# Altium project SmartHaloEE.PrjPcb (part 2 of 2)

## Sheet LEDS2.SchDoc: LEDS 2
size B; Author: Sébastien Gélinas; Organization: SmartHalo; Address1: 5445 de Gaspé; Address2: Montréal, QC; Address3: Canada; Address4: H2T 3B2; Revision: 1; SheetNumber: 4; SheetTotal: 4
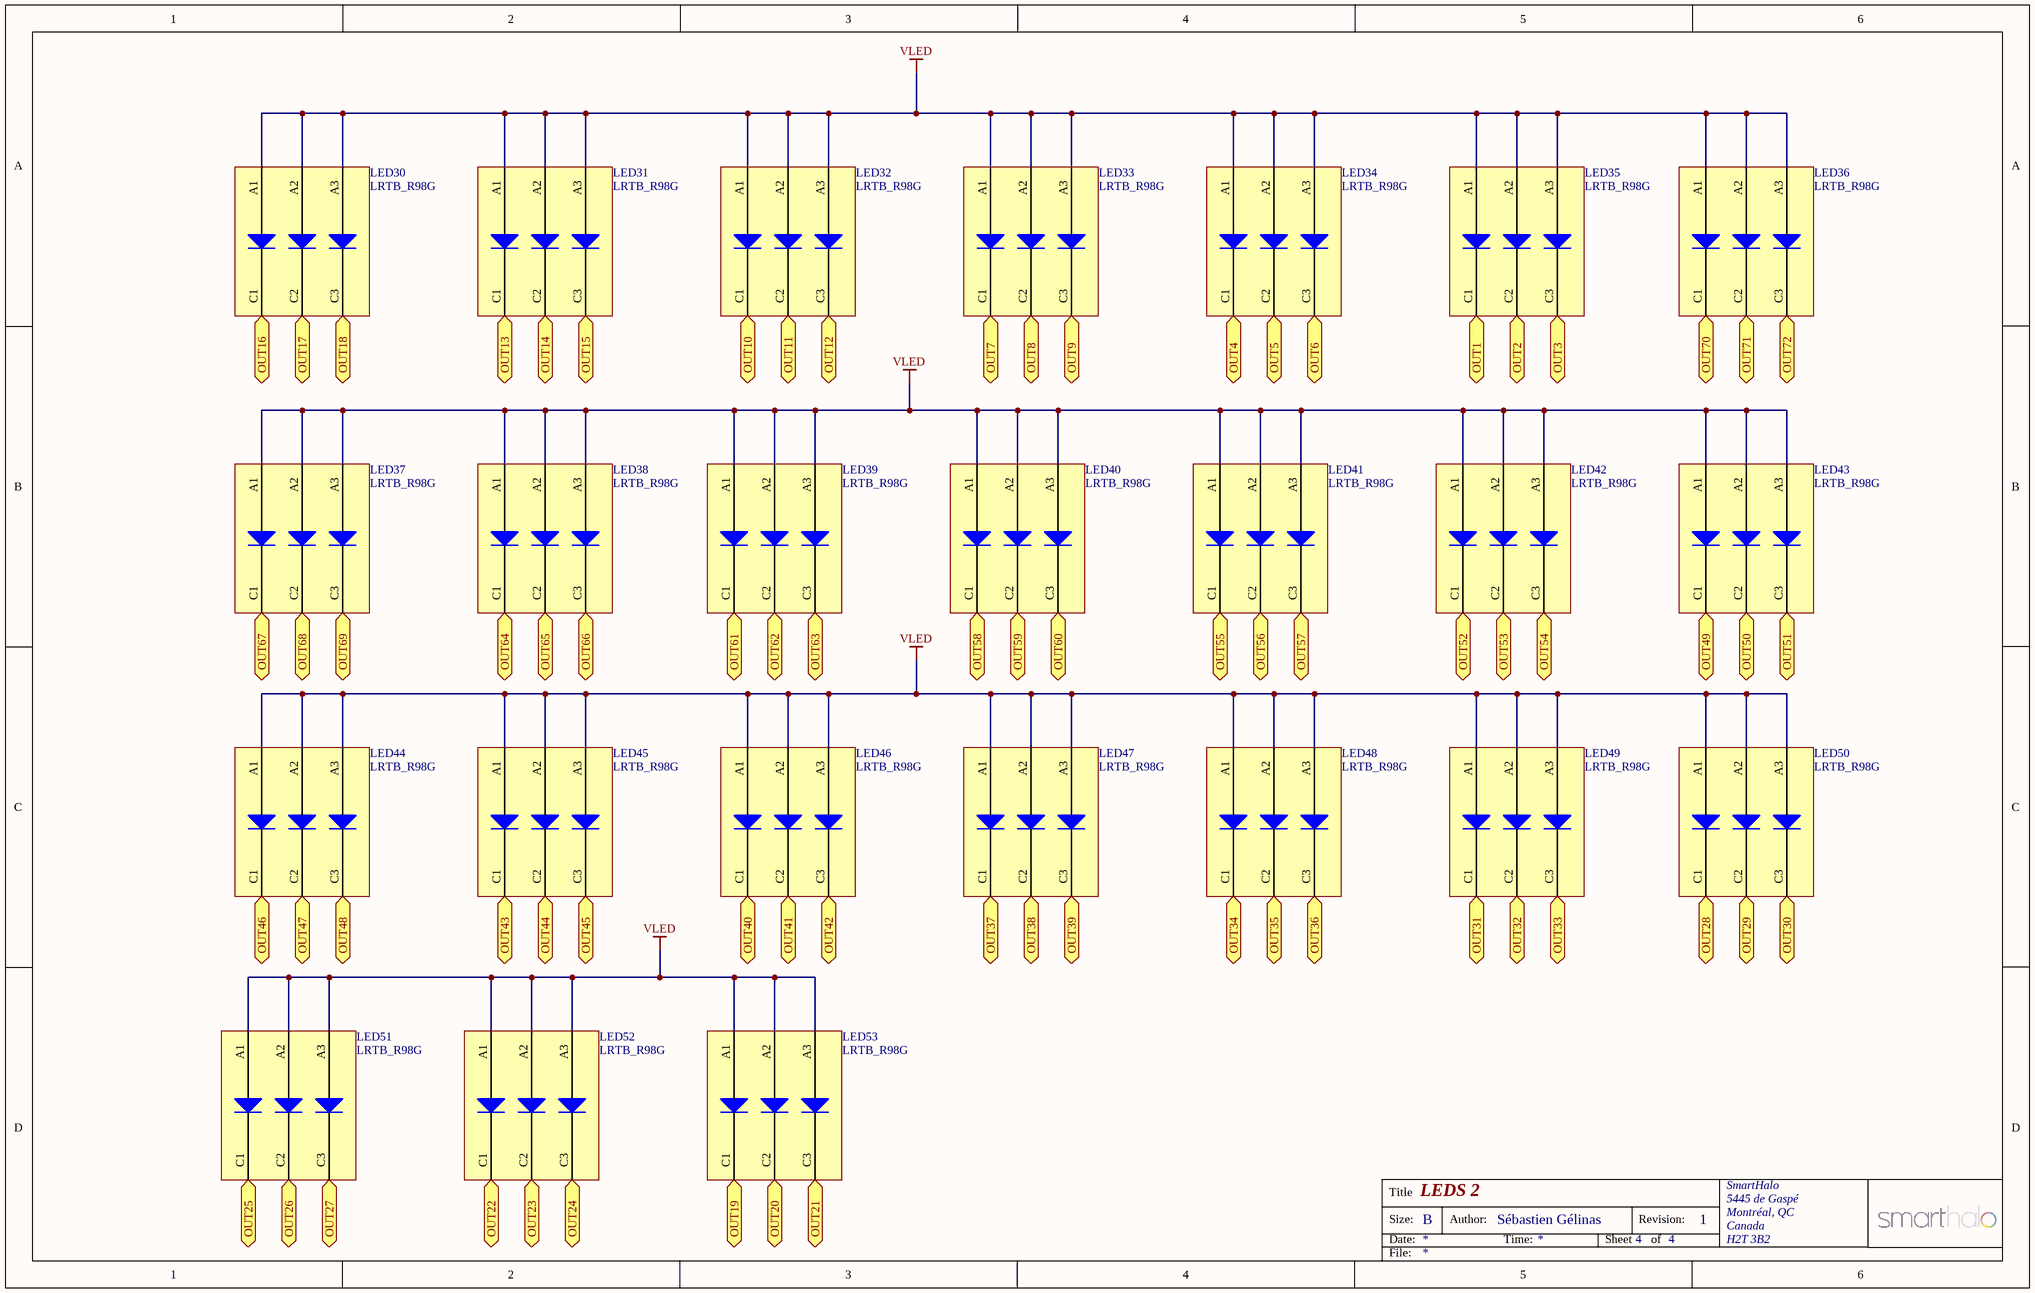
[diagram p7: LEDS2.SchDoc]

### Parts
LED30  LRTB_R98G  [LRTB_R98G]
LED31  LRTB_R98G  [LRTB_R98G]
LED32  LRTB_R98G  [LRTB_R98G]
LED33  LRTB_R98G  [LRTB_R98G]
LED34  LRTB_R98G  [LRTB_R98G]
LED35  LRTB_R98G  [LRTB_R98G]
LED36  LRTB_R98G  [LRTB_R98G]
LED37  LRTB_R98G  [LRTB_R98G]
LED38  LRTB_R98G  [LRTB_R98G]
LED39  LRTB_R98G  [LRTB_R98G]
LED40  LRTB_R98G  [LRTB_R98G]
LED41  LRTB_R98G  [LRTB_R98G]
LED42  LRTB_R98G  [LRTB_R98G]
LED43  LRTB_R98G  [LRTB_R98G]
LED44  LRTB_R98G  [LRTB_R98G]
LED45  LRTB_R98G  [LRTB_R98G]
LED46  LRTB_R98G  [LRTB_R98G]
LED47  LRTB_R98G  [LRTB_R98G]
LED48  LRTB_R98G  [LRTB_R98G]
LED49  LRTB_R98G  [LRTB_R98G]
LED50  LRTB_R98G  [LRTB_R98G]
LED51  LRTB_R98G  [LRTB_R98G]
LED52  LRTB_R98G  [LRTB_R98G]
LED53  LRTB_R98G  [LRTB_R98G]

### Ports
OUT1, OUT2, OUT3, OUT4, OUT5, OUT6, OUT7, OUT8, OUT9, OUT10, OUT11, OUT12, OUT13, OUT14, OUT15, OUT16, OUT17, OUT18, OUT19, OUT20, OUT21, OUT22, OUT23, OUT24, OUT25, OUT26, OUT27, OUT28, OUT29, OUT30, OUT31, OUT32, OUT33, OUT34, OUT35, OUT36, OUT37, OUT38, OUT39, OUT40, OUT41, OUT42, OUT43, OUT44, OUT45, OUT46, OUT47, OUT48, OUT49, OUT50, OUT51, OUT52, OUT53, OUT54, OUT55, OUT56, OUT57, OUT58, OUT59, OUT60, OUT61, OUT62, OUT63, OUT64, OUT65, OUT66, OUT67, OUT68, OUT69, OUT70, OUT71, OUT72

### Nets
VLED: LED30.A1(Anode_Blue) LED30.A2(Anode_Green) LED30.A3(Anode_Red) LED31.A1(Anode_Blue) LED31.A2(Anode_Green) LED31.A3(Anode_Red) LED32.A1(Anode_Blue) LED32.A2(Anode_Green) LED32.A3(Anode_Red) LED33.A1(Anode_Blue) LED33.A2(Anode_Green) LED33.A3(Anode_Red) LED34.A1(Anode_Blue) LED34.A2(Anode_Green) LED34.A3(Anode_Red) LED35.A1(Anode_Blue) LED35.A2(Anode_Green) LED35.A3(Anode_Red) LED36.A1(Anode_Blue) LED36.A2(Anode_Green) LED36.A3(Anode_Red) LED37.A1(Anode_Blue) LED37.A2(Anode_Green) LED37.A3(Anode_Red) LED38.A1(Anode_Blue) LED38.A2(Anode_Green) LED38.A3(Anode_Red) LED39.A1(Anode_Blue) LED39.A2(Anode_Green) LED39.A3(Anode_Red) LED40.A1(Anode_Blue) LED40.A2(Anode_Green) LED40.A3(Anode_Red) LED41.A1(Anode_Blue) LED41.A2(Anode_Green) LED41.A3(Anode_Red) LED42.A1(Anode_Blue) LED42.A2(Anode_Green) LED42.A3(Anode_Red) LED43.A1(Anode_Blue) LED43.A2(Anode_Green) LED43.A3(Anode_Red) LED44.A1(Anode_Blue) LED44.A2(Anode_Green) LED44.A3(Anode_Red) LED45.A1(Anode_Blue) LED45.A2(Anode_Green) LED45.A3(Anode_Red) LED46.A1(Anode_Blue) LED46.A2(Anode_Green) LED46.A3(Anode_Red) LED47.A1(Anode_Blue) LED47.A2(Anode_Green) LED47.A3(Anode_Red) LED48.A1(Anode_Blue) LED48.A2(Anode_Green) LED48.A3(Anode_Red) LED49.A1(Anode_Blue) LED49.A2(Anode_Green) LED49.A3(Anode_Red) LED50.A1(Anode_Blue) LED50.A2(Anode_Green) LED50.A3(Anode_Red) LED51.A1(Anode_Blue) LED51.A2(Anode_Green) LED51.A3(Anode_Red) LED52.A1(Anode_Blue) LED52.A2(Anode_Green) LED52.A3(Anode_Red) LED53.A1(Anode_Blue) LED53.A2(Anode_Green) LED53.A3(Anode_Red)
NetLED6_C1: LED53.C1(Cathode_Blue) ; port OUT19
NetLED6_C2: LED53.C2(Cathode_Green) ; port OUT20
NetLED6_C3: LED53.C3(Cathode_Red) ; port OUT21
NetLED7_C1: LED30.C1(Cathode_Blue) ; port OUT16
NetLED7_C2: LED30.C2(Cathode_Green) ; port OUT17
NetLED7_C3: LED30.C3(Cathode_Red) ; port OUT18
NetLED8_C1: LED31.C1(Cathode_Blue) ; port OUT13
NetLED8_C2: LED31.C2(Cathode_Green) ; port OUT14
NetLED8_C3: LED31.C3(Cathode_Red) ; port OUT15
NetLED9_C1: LED32.C1(Cathode_Blue) ; port OUT10
NetLED9_C2: LED32.C2(Cathode_Green) ; port OUT11
NetLED9_C3: LED32.C3(Cathode_Red) ; port OUT12
NetLED10_C1: LED33.C1(Cathode_Blue) ; port OUT7
NetLED10_C2: LED33.C2(Cathode_Green) ; port OUT8
NetLED10_C3: LED33.C3(Cathode_Red) ; port OUT9
NetLED11_C1: LED34.C1(Cathode_Blue) ; port OUT4
NetLED11_C2: LED34.C2(Cathode_Green) ; port OUT5
NetLED11_C3: LED34.C3(Cathode_Red) ; port OUT6
NetLED12_C1: LED35.C1(Cathode_Blue) ; port OUT1
NetLED12_C2: LED35.C2(Cathode_Green) ; port OUT2
NetLED12_C3: LED35.C3(Cathode_Red) ; port OUT3
NetLED13_C1: LED36.C1(Cathode_Blue) ; port OUT70
NetLED13_C2: LED36.C2(Cathode_Green) ; port OUT71
NetLED13_C3: LED36.C3(Cathode_Red) ; port OUT72
NetLED14_C1: LED37.C1(Cathode_Blue) ; port OUT67
NetLED14_C2: LED37.C2(Cathode_Green) ; port OUT68
NetLED14_C3: LED37.C3(Cathode_Red) ; port OUT69
NetLED15_C1: LED38.C1(Cathode_Blue) ; port OUT64
NetLED15_C2: LED38.C2(Cathode_Green) ; port OUT65
NetLED15_C3: LED38.C3(Cathode_Red) ; port OUT66
NetLED16_C1: LED39.C1(Cathode_Blue) ; port OUT61
NetLED16_C2: LED39.C2(Cathode_Green) ; port OUT62
NetLED16_C3: LED39.C3(Cathode_Red) ; port OUT63
NetLED17_C1: LED40.C1(Cathode_Blue) ; port OUT58
NetLED17_C2: LED40.C2(Cathode_Green) ; port OUT59
NetLED17_C3: LED40.C3(Cathode_Red) ; port OUT60
NetLED18_C1: LED41.C1(Cathode_Blue) ; port OUT55
NetLED18_C2: LED41.C2(Cathode_Green) ; port OUT56
NetLED18_C3: LED41.C3(Cathode_Red) ; port OUT57
NetLED19_C1: LED42.C1(Cathode_Blue) ; port OUT52
NetLED19_C2: LED42.C2(Cathode_Green) ; port OUT53
NetLED19_C3: LED42.C3(Cathode_Red) ; port OUT54
NetLED20_C1: LED43.C1(Cathode_Blue) ; port OUT49
NetLED20_C2: LED43.C2(Cathode_Green) ; port OUT50
NetLED20_C3: LED43.C3(Cathode_Red) ; port OUT51
NetLED21_C1: LED44.C1(Cathode_Blue) ; port OUT46
NetLED21_C2: LED44.C2(Cathode_Green) ; port OUT47
NetLED21_C3: LED44.C3(Cathode_Red) ; port OUT48
NetLED22_C1: LED45.C1(Cathode_Blue) ; port OUT43
NetLED22_C2: LED45.C2(Cathode_Green) ; port OUT44
NetLED22_C3: LED45.C3(Cathode_Red) ; port OUT45
NetLED23_C1: LED46.C1(Cathode_Blue) ; port OUT40
NetLED23_C2: LED46.C2(Cathode_Green) ; port OUT41
NetLED23_C3: LED46.C3(Cathode_Red) ; port OUT42
NetLED24_C1: LED47.C1(Cathode_Blue) ; port OUT37
NetLED24_C2: LED47.C2(Cathode_Green) ; port OUT38
NetLED24_C3: LED47.C3(Cathode_Red) ; port OUT39
NetLED25_C1: LED48.C1(Cathode_Blue) ; port OUT34
NetLED25_C2: LED48.C2(Cathode_Green) ; port OUT35
NetLED25_C3: LED48.C3(Cathode_Red) ; port OUT36
NetLED26_C1: LED49.C1(Cathode_Blue) ; port OUT31
NetLED26_C2: LED49.C2(Cathode_Green) ; port OUT32
NetLED26_C3: LED49.C3(Cathode_Red) ; port OUT33
NetLED27_C1: LED50.C1(Cathode_Blue) ; port OUT28
NetLED27_C2: LED50.C2(Cathode_Green) ; port OUT29
NetLED27_C3: LED50.C3(Cathode_Red) ; port OUT30
NetLED28_C1: LED51.C1(Cathode_Blue) ; port OUT25
NetLED28_C2: LED51.C2(Cathode_Green) ; port OUT26
NetLED28_C3: LED51.C3(Cathode_Red) ; port OUT27
NetLED29_C1: LED52.C1(Cathode_Blue) ; port OUT22
NetLED29_C2: LED52.C2(Cathode_Green) ; port OUT23
NetLED29_C3: LED52.C3(Cathode_Red) ; port OUT24

### Notes on the sheet
- Title
- Size:
- Date:
- B
- Author:
- Time:
- Sheet
- Revision:
- of
- File:

### Library data of the parts
LED30-LED53 = LRTB_R98G: IC RGB LED OSRAM; Manufacturer: OSRAM

## Nets that join several sheets
+3.3: PWR (C17.2 U3.5), SENSORS (8 pins), BLE (11 pins)
GND: PWR (29 pins), SENSORS (8 pins), BLE (20 pins), ALARM (Q2.2), DRIVERS_CONNECTORS (25 pins)
VBZ: PWR (C3.2 D1.1 R1.2), ALARM (NT2.1)
VLED: PWR (NT3.2), DRIVERS_CONNECTORS (14 pins), LEDS1 (72 pins), LEDS2 (72 pins)
ANODE_B: CENTRALLEDS (5 pins), DRIVERS_CONNECTORS (R26.1)
ANODE_G: CENTRALLEDS (5 pins), DRIVERS_CONNECTORS (R7.1)
ANODE_R: CENTRALLEDS (5 pins), DRIVERS_CONNECTORS (R25.1)
CENTRAL_B: BLE (U4.5), DRIVERS_CONNECTORS (R28.2)
CENTRAL_G: BLE (U4.7), DRIVERS_CONNECTORS (R9.2)
CENTRAL_R: BLE (U4.6), DRIVERS_CONNECTORS (R10.2)
DRDY: SENSORS (U5.11), BLE (U4.11)
FRONTLED: BLE (U4.4), DRIVERS_CONNECTORS (R27.2)
INT_MAG: SENSORS (U5.7), BLE (U4.9)
INT_XL: SENSORS (U5.12), BLE (U4.10)
NetLED1_C1: CENTRALLEDS (5 pins), DRIVERS_CONNECTORS (Q5.6)
NetLED1_C2: CENTRALLEDS (5 pins), DRIVERS_CONNECTORS (Q6.3)
NetLED1_C3: CENTRALLEDS (5 pins), DRIVERS_CONNECTORS (Q6.6)
NetLED6_C1: DRIVERS_CONNECTORS (U6.20), LEDS1 (LED6.C1), LEDS2 (LED53.C1)
NetLED6_C2: DRIVERS_CONNECTORS (U6.21), LEDS1 (LED6.C2), LEDS2 (LED53.C2)
NetLED6_C3: DRIVERS_CONNECTORS (U6.22), LEDS1 (LED6.C3), LEDS2 (LED53.C3)
NetLED7_C1: DRIVERS_CONNECTORS (U6.15), LEDS1 (LED7.C1), LEDS2 (LED30.C1)
NetLED7_C2: DRIVERS_CONNECTORS (U6.16), LEDS1 (LED7.C2), LEDS2 (LED30.C2)
NetLED7_C3: DRIVERS_CONNECTORS (U6.17), LEDS1 (LED7.C3), LEDS2 (LED30.C3)
NetLED8_C1: DRIVERS_CONNECTORS (U6.12), LEDS1 (LED8.C1), LEDS2 (LED31.C1)
NetLED8_C2: DRIVERS_CONNECTORS (U6.13), LEDS1 (LED8.C2), LEDS2 (LED31.C2)
NetLED8_C3: DRIVERS_CONNECTORS (U6.14), LEDS1 (LED8.C3), LEDS2 (LED31.C3)
NetLED9_C1: DRIVERS_CONNECTORS (U6.9), LEDS1 (LED9.C1), LEDS2 (LED32.C1)
NetLED9_C2: DRIVERS_CONNECTORS (U6.10), LEDS1 (LED9.C2), LEDS2 (LED32.C2)
NetLED9_C3: DRIVERS_CONNECTORS (U6.11), LEDS1 (LED9.C3), LEDS2 (LED32.C3)
NetLED10_C1: DRIVERS_CONNECTORS (U6.6), LEDS1 (LED10.C1), LEDS2 (LED33.C1)
NetLED10_C2: DRIVERS_CONNECTORS (U6.7), LEDS1 (LED10.C2), LEDS2 (LED33.C2)
NetLED10_C3: DRIVERS_CONNECTORS (U6.8), LEDS1 (LED10.C3), LEDS2 (LED33.C3)
NetLED11_C1: DRIVERS_CONNECTORS (U6.2), LEDS1 (LED11.C1), LEDS2 (LED34.C1)
NetLED11_C2: DRIVERS_CONNECTORS (U6.3), LEDS1 (LED11.C2), LEDS2 (LED34.C2)
NetLED11_C3: DRIVERS_CONNECTORS (U6.5), LEDS1 (LED11.C3), LEDS2 (LED34.C3)
NetLED12_C1: DRIVERS_CONNECTORS (U6.47), LEDS1 (LED12.C1), LEDS2 (LED35.C1)
NetLED12_C2: DRIVERS_CONNECTORS (U6.48), LEDS1 (LED12.C2), LEDS2 (LED35.C2)
NetLED12_C3: DRIVERS_CONNECTORS (U6.1), LEDS1 (LED12.C3), LEDS2 (LED35.C3)
NetLED13_C1: DRIVERS_CONNECTORS (U8.36), LEDS1 (LED13.C1), LEDS2 (LED36.C1)
NetLED13_C2: DRIVERS_CONNECTORS (U8.37), LEDS1 (LED13.C2), LEDS2 (LED36.C2)
NetLED13_C3: DRIVERS_CONNECTORS (U8.38), LEDS1 (LED13.C3), LEDS2 (LED36.C3)
NetLED14_C1: DRIVERS_CONNECTORS (U8.32), LEDS1 (LED14.C1), LEDS2 (LED37.C1)
NetLED14_C2: DRIVERS_CONNECTORS (U8.34), LEDS1 (LED14.C2), LEDS2 (LED37.C2)
NetLED14_C3: DRIVERS_CONNECTORS (U8.35), LEDS1 (LED14.C3), LEDS2 (LED37.C3)
NetLED15_C1: DRIVERS_CONNECTORS (U8.29), LEDS1 (LED15.C1), LEDS2 (LED38.C1)
NetLED15_C2: DRIVERS_CONNECTORS (U8.30), LEDS1 (LED15.C2), LEDS2 (LED38.C2)
NetLED15_C3: DRIVERS_CONNECTORS (U8.31), LEDS1 (LED15.C3), LEDS2 (LED38.C3)
NetLED16_C1: DRIVERS_CONNECTORS (U8.26), LEDS1 (LED16.C1), LEDS2 (LED39.C1)
NetLED16_C2: DRIVERS_CONNECTORS (U8.27), LEDS1 (LED16.C2), LEDS2 (LED39.C2)
NetLED16_C3: DRIVERS_CONNECTORS (U8.28), LEDS1 (LED16.C3), LEDS2 (LED39.C3)
NetLED17_C1: DRIVERS_CONNECTORS (U8.23), LEDS1 (LED17.C1), LEDS2 (LED40.C1)
NetLED17_C2: DRIVERS_CONNECTORS (U8.24), LEDS1 (LED17.C2), LEDS2 (LED40.C2)
NetLED17_C3: DRIVERS_CONNECTORS (U8.25), LEDS1 (LED17.C3), LEDS2 (LED40.C3)
NetLED18_C1: DRIVERS_CONNECTORS (U8.20), LEDS1 (LED18.C1), LEDS2 (LED41.C1)
NetLED18_C2: DRIVERS_CONNECTORS (U8.21), LEDS1 (LED18.C2), LEDS2 (LED41.C2)
NetLED18_C3: DRIVERS_CONNECTORS (U8.22), LEDS1 (LED18.C3), LEDS2 (LED41.C3)
NetLED19_C1: DRIVERS_CONNECTORS (U8.15), LEDS1 (LED19.C1), LEDS2 (LED42.C1)
NetLED19_C2: DRIVERS_CONNECTORS (U8.16), LEDS1 (LED19.C2), LEDS2 (LED42.C2)
NetLED19_C3: DRIVERS_CONNECTORS (U8.17), LEDS1 (LED19.C3), LEDS2 (LED42.C3)
NetLED20_C1: DRIVERS_CONNECTORS (U8.12), LEDS1 (LED20.C1), LEDS2 (LED43.C1)
NetLED20_C2: DRIVERS_CONNECTORS (U8.13), LEDS1 (LED20.C2), LEDS2 (LED43.C2)
NetLED20_C3: DRIVERS_CONNECTORS (U8.14), LEDS1 (LED20.C3), LEDS2 (LED43.C3)
NetLED21_C1: DRIVERS_CONNECTORS (U8.9), LEDS1 (LED21.C1), LEDS2 (LED44.C1)
NetLED21_C2: DRIVERS_CONNECTORS (U8.10), LEDS1 (LED21.C2), LEDS2 (LED44.C2)
NetLED21_C3: DRIVERS_CONNECTORS (U8.11), LEDS1 (LED21.C3), LEDS2 (LED44.C3)
NetLED22_C1: DRIVERS_CONNECTORS (U8.6), LEDS1 (LED22.C1), LEDS2 (LED45.C1)
NetLED22_C2: DRIVERS_CONNECTORS (U8.7), LEDS1 (LED22.C2), LEDS2 (LED45.C2)
NetLED22_C3: DRIVERS_CONNECTORS (U8.8), LEDS1 (LED22.C3), LEDS2 (LED45.C3)
NetLED23_C1: DRIVERS_CONNECTORS (U8.2), LEDS1 (LED23.C1), LEDS2 (LED46.C1)
NetLED23_C2: DRIVERS_CONNECTORS (U8.3), LEDS1 (LED23.C2), LEDS2 (LED46.C2)
NetLED23_C3: DRIVERS_CONNECTORS (U8.5), LEDS1 (LED23.C3), LEDS2 (LED46.C3)
NetLED24_C1: DRIVERS_CONNECTORS (U8.47), LEDS1 (LED24.C1), LEDS2 (LED47.C1)
NetLED24_C2: DRIVERS_CONNECTORS (U8.48), LEDS1 (LED24.C2), LEDS2 (LED47.C2)
NetLED24_C3: DRIVERS_CONNECTORS (U8.1), LEDS1 (LED24.C3), LEDS2 (LED47.C3)
NetLED25_C1: DRIVERS_CONNECTORS (U6.36), LEDS1 (LED25.C1), LEDS2 (LED48.C1)
NetLED25_C2: DRIVERS_CONNECTORS (U6.37), LEDS1 (LED25.C2), LEDS2 (LED48.C2)
NetLED25_C3: DRIVERS_CONNECTORS (U6.38), LEDS1 (LED25.C3), LEDS2 (LED48.C3)
NetLED26_C1: DRIVERS_CONNECTORS (U6.32), LEDS1 (LED26.C1), LEDS2 (LED49.C1)
NetLED26_C2: DRIVERS_CONNECTORS (U6.34), LEDS1 (LED26.C2), LEDS2 (LED49.C2)
NetLED26_C3: DRIVERS_CONNECTORS (U6.35), LEDS1 (LED26.C3), LEDS2 (LED49.C3)
NetLED27_C1: DRIVERS_CONNECTORS (U6.29), LEDS1 (LED27.C1), LEDS2 (LED50.C1)
NetLED27_C2: DRIVERS_CONNECTORS (U6.30), LEDS1 (LED27.C2), LEDS2 (LED50.C2)
NetLED27_C3: DRIVERS_CONNECTORS (U6.31), LEDS1 (LED27.C3), LEDS2 (LED50.C3)
NetLED28_C1: DRIVERS_CONNECTORS (U6.26), LEDS1 (LED28.C1), LEDS2 (LED51.C1)
NetLED28_C2: DRIVERS_CONNECTORS (U6.27), LEDS1 (LED28.C2), LEDS2 (LED51.C2)
NetLED28_C3: DRIVERS_CONNECTORS (U6.28), LEDS1 (LED28.C3), LEDS2 (LED51.C3)
NetLED29_C1: DRIVERS_CONNECTORS (U6.23), LEDS1 (LED29.C1), LEDS2 (LED52.C1)
NetLED29_C2: DRIVERS_CONNECTORS (U6.24), LEDS1 (LED29.C2), LEDS2 (LED52.C2)
NetLED29_C3: DRIVERS_CONNECTORS (U6.25), LEDS1 (LED29.C3), LEDS2 (LED52.C3)
P0.04: BLE (U4.8), ALARM (R18.1)
P0.08: SENSORS (U9.1), BLE (U4.14)
P0.09: SENSORS (U9.6), BLE (U4.15)
P0.11: SENSORS (U5.4), BLE (Q3.2 R11.1 U4.17)
P0.30: PWR (U1.7), BLE (U4.3)
SCL: SENSORS (U5.1), BLE (Q1.2 R8.1 U4.16)
SCL_5V: BLE (Q1.3), DRIVERS_CONNECTORS (R15.1 U6.46 U8.46)
SDA_5V: BLE (Q3.3), DRIVERS_CONNECTORS (R16.1 U6.45 U8.45)
SDB_5V: BLE (Q4.3), DRIVERS_CONNECTORS (R22.1 U6.39 U8.39)

## Assembly variants
: all parts fitted